# EAGLE design T09_LockBox_ver6 (EAGLE 7.7.0)
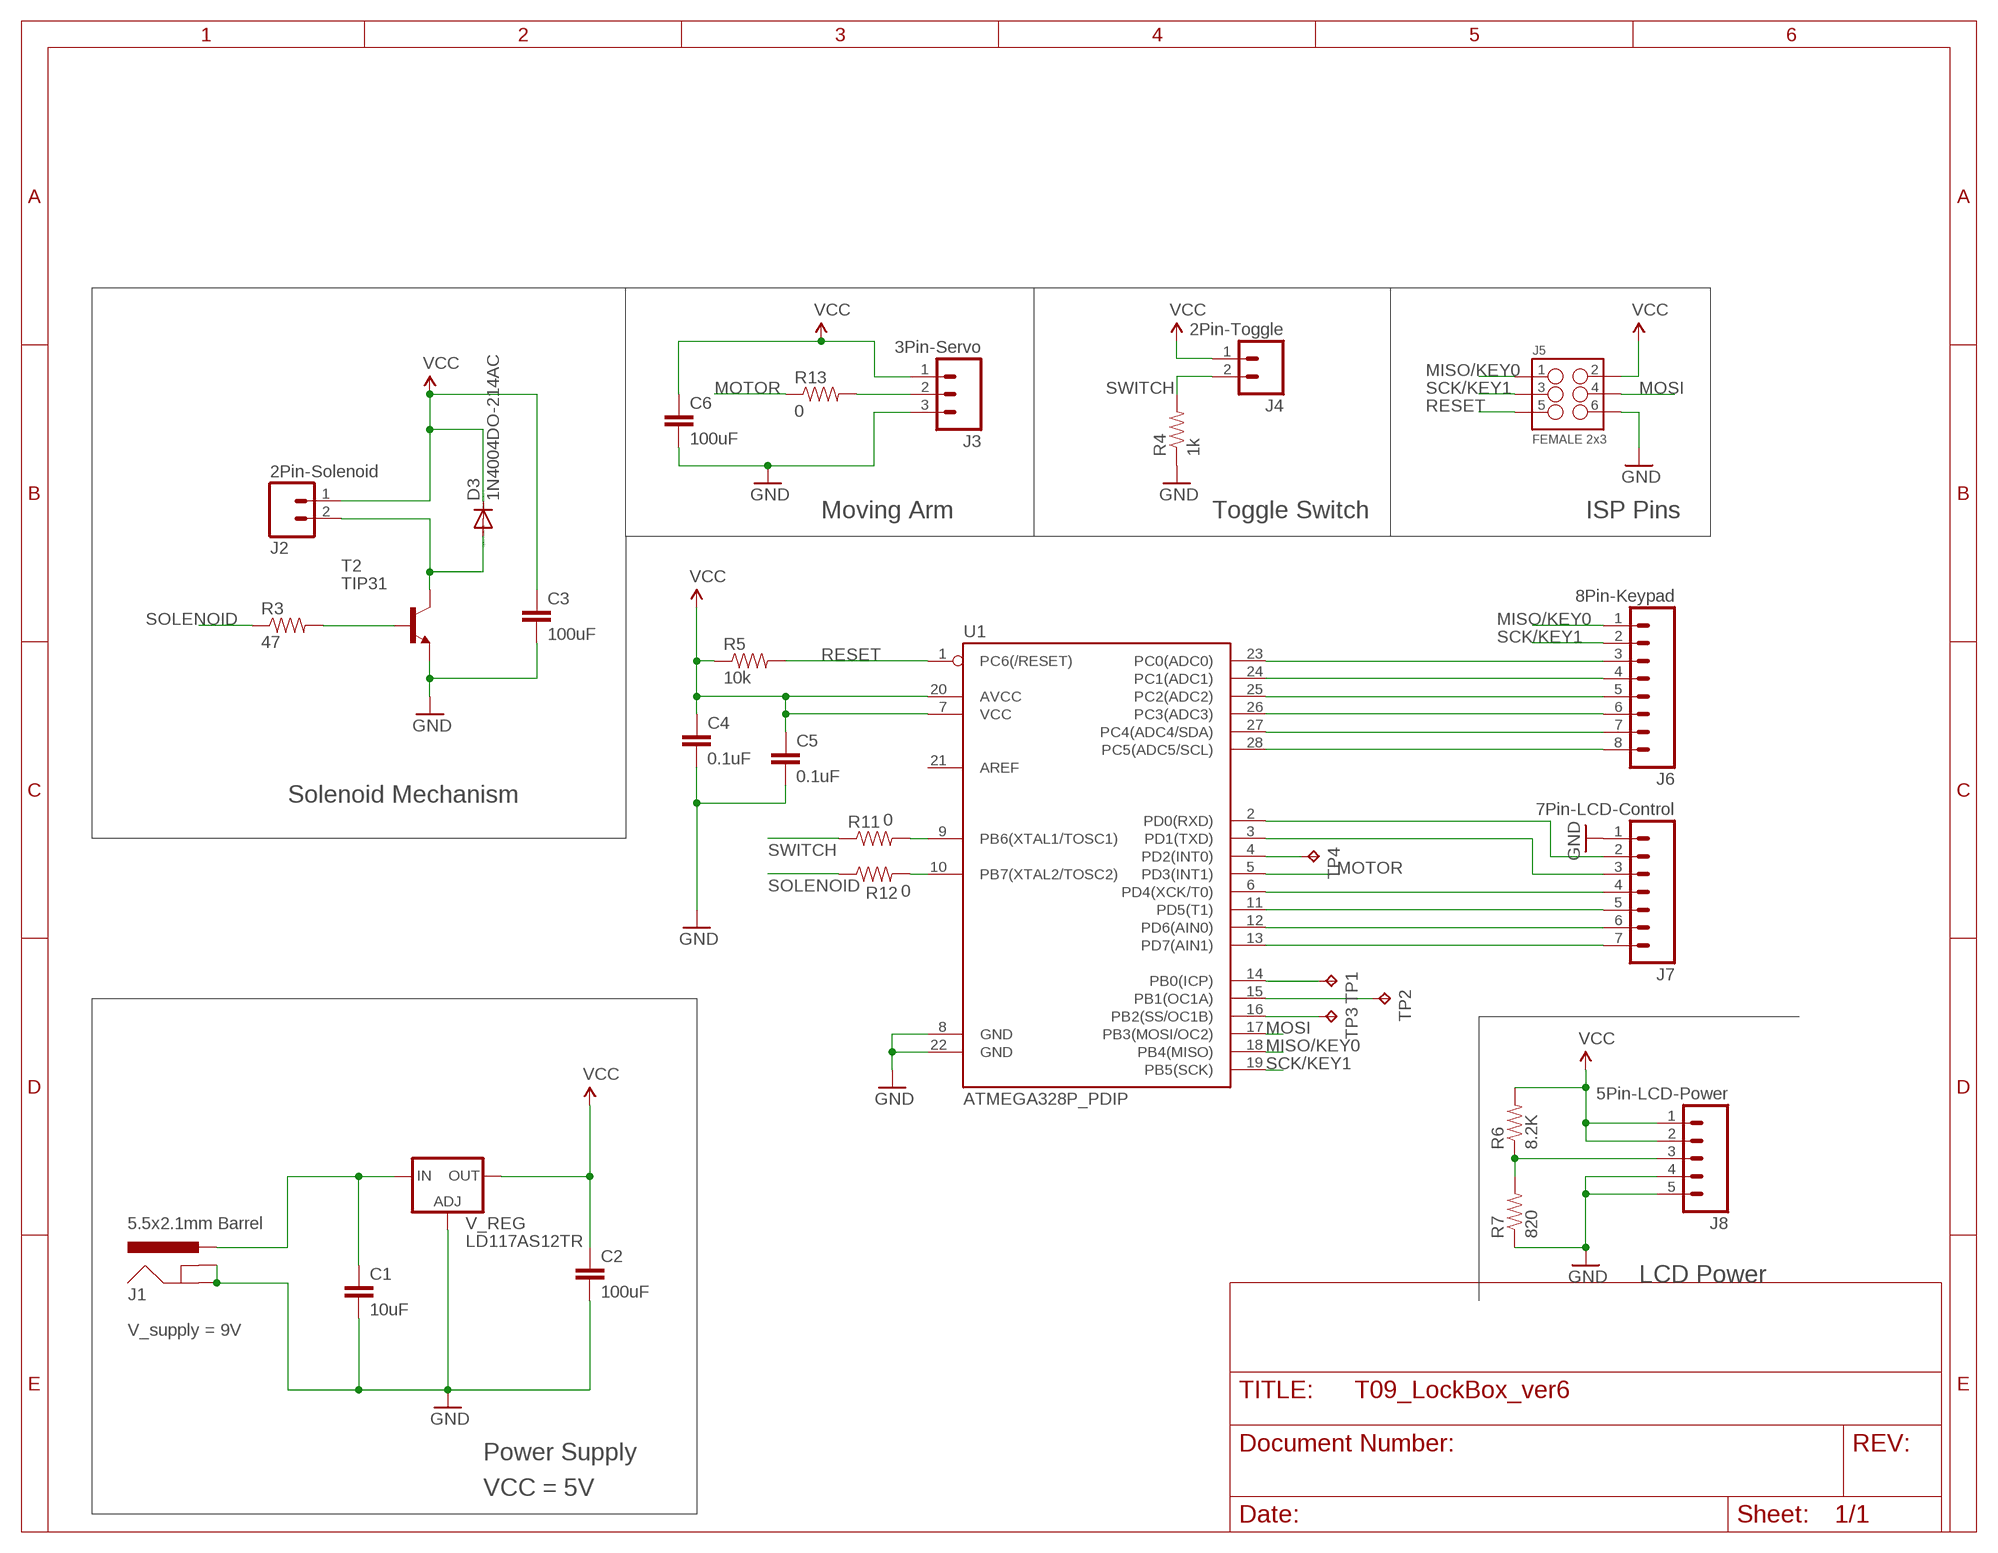
[diagram p0: schematic, sheet 1]

## Parts
C1  10uF  CAP0603-CAP  [0603-CAP]
C2  100uF  CAP0603-CAP  [0603-CAP]
C3  100uF  CAP0603-CAP  [0603-CAP]
C4  0.1uF  CAP0603-CAP  [0603-CAP]
C5  0.1uF  CAP0603-CAP  [0603-CAP]
C6  100uF  CAP0603-CAP  [0603-CAP]
D3  1N4004DO-214AC  [DO-214AC]
J1  5.5x2.1mm Barrel  POWER_JACKSMD  [POWER_JACK_SMD]
J2  2Pin-Solenoid  M02PTH  [1X02]
J3  3Pin-Servo  M03PTH  [1X03]
J4  2Pin-Toggle  M02PTH  [1X02]
J5  FEMALE 2x3  M03X2FEMALE  [2X3]
J6  8Pin-Keypad  M08  [1X08_ROUND]
J7  7Pin-LCD-Control  M07  [1X07]
J8  5Pin-LCD-Power  M05PTH  [1X05]
R3  47  RESISTOR0805-RES  [0805]
R4  1k  RESISTOR0603  [0603-RES]
R5  10k  RESISTOR0603  [0603-RES]
R6  8.2K  RESISTOR0603  [0603-RES]
R7  820  RESISTOR0603  [0603-RES]
R11  0  RESISTOR0603  [0603-RES]
R12  0  RESISTOR0603  [0603-RES]
R13  0  RESISTOR0603  [0603-RES]
T2  TIP31  [TO220]
TP1  TPPAD1-13  [P1-13]
TP2  TPPAD1-13  [P1-13]
TP3  TPPAD1-13  [P1-13]
TP4  TPPAD1-13  [P1-13]
U1  ATMEGA328P_PDIP  [DIL28-3]
V_REG  LD117AS12TR  [SOT223]

## Nets
GND: C1.2 C2.2 C3.2 C4.2 C5.2 C6.2 J1.GND(GNDBREAK) J1.P$4(GND) J3.3 J5.6 J7.1 J8.4 J8.5 R4.1 R7.1 T2.3(E) U1.8(GND) U1.22(GND) V_REG.1(ADJ)
MISO/KEY0: J5.1 J6.1 U1.18(PB4(MISO))
MOSI: J5.4 U1.17(PB3(MOSI/OC2))
MOTOR: R13.1 U1.5(PD3(INT1))
N$1: D3.A J2.2 T2.2(C)
N$2: J8.3 R6.1 R7.2
N$5: R3.2 T2.1(B)
N$8: J7.2 U1.2(PD0(RXD))
N$9: R11.2 U1.9(PB6(XTAL1/TOSC1))
N$10: R12.2 U1.10(PB7(XTAL2/TOSC2))
N$11: J3.2 R13.2
N$12: J7.3 U1.3(PD1(TXD))
N$13: J7.4 U1.6(PD4(XCK/T0))
N$14: J7.5 U1.11(PD5(T1))
N$15: J7.6 U1.12(PD6(AIN0))
N$16: J7.7 U1.13(PD7(AIN1))
N$17: J6.3 U1.23(PC0(ADC0))
N$18: J6.4 U1.24(PC1(ADC1))
N$19: J6.5 U1.25(PC2(ADC2))
N$20: J6.6 U1.26(PC3(ADC3))
N$21: J6.7 U1.27(PC4(ADC4/SDA))
N$22: J6.8 U1.28(PC5(ADC5/SCL))
N$24: TP4.TP U1.4(PD2(INT0))
N$25: TP1.TP U1.14(PB0(ICP))
N$26: TP2.TP U1.15(PB1(OC1A))
N$27: TP3.TP U1.16(PB2(SS/OC1B))
RESET: J5.5 R5.2 U1.1(PC6(/RESET))
SCK/KEY1: J5.3 J6.2 U1.19(PB5(SCK))
SOLENOID: R3.1 R12.1
SWITCH: J4.2 R4.2 R11.1
VCC: C2.1 C3.1 C4.1 C5.1 C6.1 D3.C J2.1 J3.1 J4.1 J5.2 J8.1 J8.2 R5.1 R6.2 U1.7(VCC) U1.20(AVCC) V_REG.4(OUT)
VIN: C1.1 J1.VIN0(PWR) V_REG.3(IN)
Unconnected: U1.21(AREF)

## Notes on the sheet
- Moving Arm | Toggle Switch | ISP Pins
- Solenoid Mechanism
- LCD Power
- V_supply = 9V
- Power Supply
- VCC = 5V

## Library data of the parts
C1-C6 = SparkFun-Passives:CAP: Capacitor Standard 0603 ceramic capacitor, and 0.1" leaded capacitor.
D3 = diode:1N4004: DIODE general purpose rectifier, 1 A
J1 = SparkFun-Connectors:POWER_JACK: Power Jack This is the standard 5.5mm barrel jack for power. The PTH is the most common, proven, reliable, footprint. The Slot footprint only works if the mill layer is transmitted to the PCB fab house so be warned. Mating wall wart : TOL-00298 (and others); PROD_ID: CONN-08106; SF_ID: PRT-12748
J2 J4 = SparkFun-Connectors:M02: Standard 2-pin 0.1" header. Use with - straight break away headers ( PRT-00116) - right angle break away headers (PRT-00553) - swiss pins (PRT-00743) - machine pins (PRT-00117) - female headers (PRT-00115) Molex polarized connector foot print use with: PRT-08233 with associated crimp pins and housings. 2.54_SCREWTERM for use with PRT-10571. 3.5mm Screw Terminal footprints for PRT-08084 5mm Screw Terminal footprints for use with PRT-08432
J3 = SparkFun-Connectors:M03: Header 3 Standard 3-pin 0.1" header. Use with straight break away headers (SKU : PRT-00116), right angle break away headers (PRT-00553), swiss pins (PRT-00743), machine pins (PRT-00117), and female headers (PRT-00115). Molex polarized connector foot print use with SKU : PRT-08232 with associated crimp pins and housings.
J5 = SparkFun-Connectors:M03X2: 2x3 .1" header. Shrouded, with keying- CONN-10681 SMT- CONN-11415 Pogo pins- HW-11044; PROD_ID: CONN-11566
J6 = SparkFun-Connectors:M08: Header 8 Standard 8-pin 0.1" header. Use with straight break away headers (SKU : PRT-00116), right angle break away headers (PRT-00553), swiss pins (PRT-00743), machine pins (PRT-00117), and female headers (PRT-00115).; PROD_ID: CONN-08437
J7 = SparkFun-Connectors:M07: Header 7 Standard 7-pin 0.1" header. Use with straight break away headers (SKU : PRT-00116), right angle break away headers (PRT-00553), swiss pins (PRT-00743), machine pins (PRT-00117), and female headers (PRT-00115). NOTES ON THE VARIANTS LOCK and LOCK_LONGPADS... This footprint was designed to help hold the alignment of a through-hole component (i.e. 7-pin header) while soldering it into place. You may notice that each hole has been shifted either up or down by 0.005 of an inch from it's more standard position (which is usually a perfectly straight line). This slight alteration caused the pins (the squares in the middle) to touch the edges of the holes. Because they are alternating, it causes a "brace" to hold the header in place. 0.005 has proven to be the perfect amount of "off-center" position when using our standard breakaway headers. Although looks a little odd when you look at the bare footprint, once you have a header in there, the alteration is very hard to notice. Also, if you push a header all the way into place, it is covered up entirely on the bottom side. This idea of altering the position of holes to aid alignment will be further integrated into the Sparkfun Library for other footprints. It can help hold any component with 3 or more connection pins.
J8 = SparkFun-Connectors:M05: Header 5 Standard 5-pin 0.1" header. Use with straight break away headers (SKU : PRT-00116), right angle break away headers (PRT-00553), swiss pins (PRT-00743), machine pins (PRT-00117), and female headers (PRT-00115). Molex polarized connector foot print use with SKU : PRT-08230 with associated crimp pins and housings.
R3-R7 R11-R13 = SparkFun-Resistors:RESISTOR: Resistor Basic schematic elements and footprints for 0603, 1206, and PTH resistors.
T2 = transistor:TIP31: NPN Transistor Medium Power Linear Switching Applications Source: http://onsemi.com
TP1-TP4 = testpad:TP: Test pad
U1 = SparkFun-DigitalIC:ATMEGA328P_PDIP: uC used in the Arduino 32kb flash, 1k EEPROM, 2k SRAM This is the through-hole version of this chip.
V_REG = v-reg:LD117A?*: Low drop fixed and adjustable positive voltage regulators 1 A Source: http://www.st.com/stonline/products/literature/ds/7194/ld1117axx.pdf

## Board
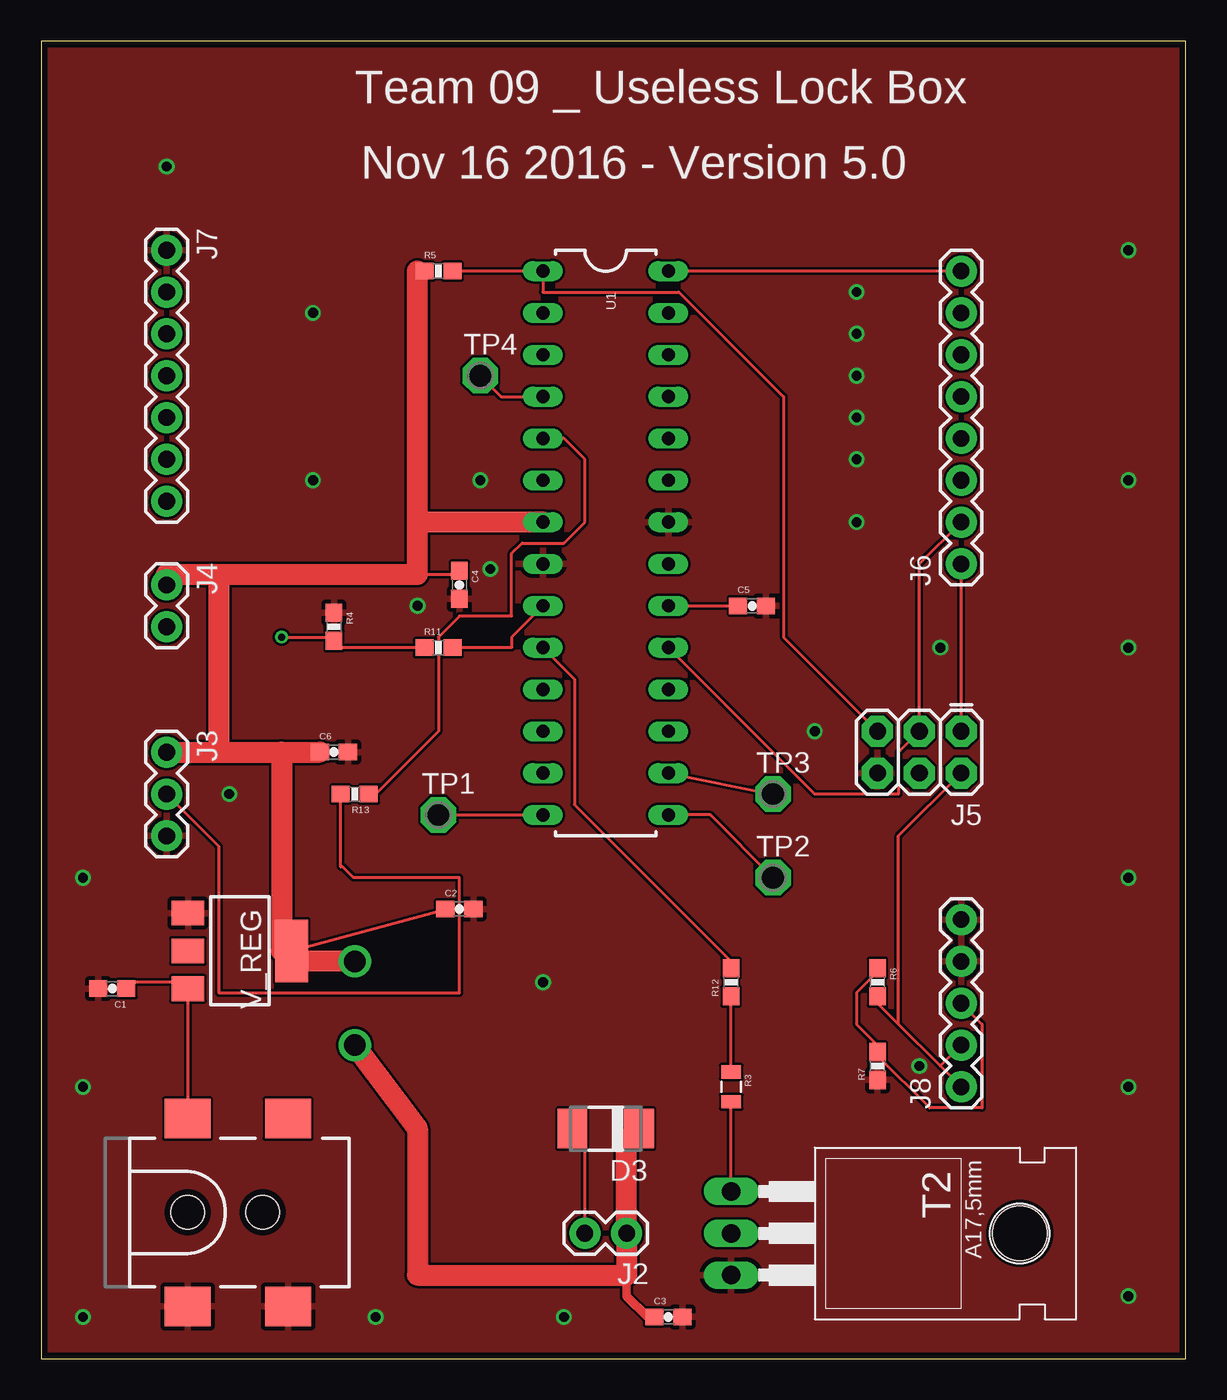
[diagram p1: board, top side]
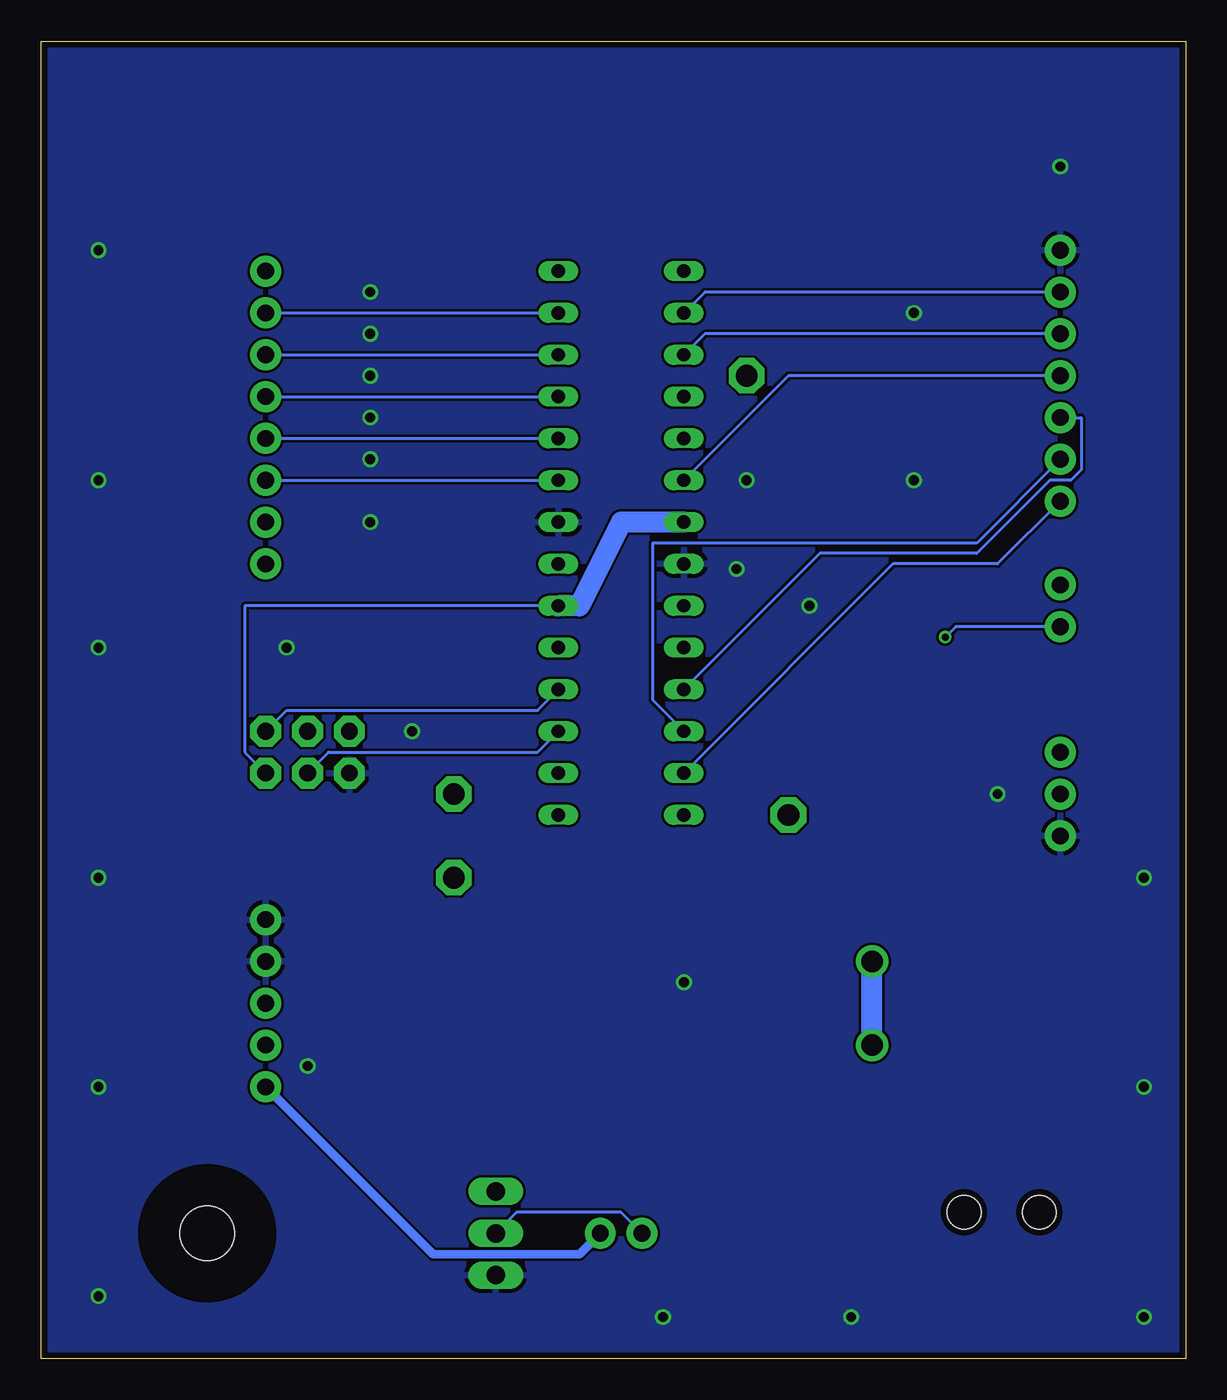
[diagram p2: board, bottom side, seen from below]

Size 69.52 x 80 mm. Coordinates in mm from the lower left corner, seen from the top.
Outline: 0,0 69.52,0 69.52,80 0,80 0,0
Copper layers (1*16): Top 0.0356mm / dielectric 1.5011mm / Bottom 0.0356mm
Design rules "OSH-Park-2-layer": minimum track width 6mil, minimum drill 13mil, track to track 6mil, track to pad 6mil, pad to pad 6mil, via to via 6mil, smd to smd 6mil, copper to edge 15mil, drill to drill 6mil, minimum pad ring 7mil, minimum via ring 7mil, stop-mask expansion 3mil, vias tented up to drill 0mil, thermal gap 10mil

### Footprints (pad centres in the part's own frame; a part is rotated, then mirrored left to right if it is on the bottom)
0603-CAP = smd 1.1 x 1: 1 -0.85,0; 2 0.85,0
DO-214AC = smd 1.8 x 2.4: A 2.025,0; C -2.025,0
POWER_JACK_SMD = smd 2.8 x 2.4: GND 0,-5.7; P$4 6.1,-5.7; VIN0 0,5.7; VIN1 6.1,5.7 | hole 2.032: 0,0; 4.572,0
1X02 = drill 1.016 pad 1.88: 1 0,0; 2 2.54,0
1X03 = drill 1.016 pad 1.88: 1 0,0; 2 2.54,0; 3 5.08,0
2X3 = drill 1.016 pad 1.88 octagon: 1 0,0; 2 0,2.54; 3 2.54,0; 4 2.54,2.54; 5 5.08,0; 6 5.08,2.54
1X08_ROUND = drill 1.016 pad 1.88: 1 0,0; 2 2.54,0; 3 5.08,0; 4 7.62,0; 5 10.16,0; 6 12.7,0; 7 15.24,0; 8 17.78,0
1X07 = drill 1.016 pad 1.88: 1 0,0; 2 2.54,0; 3 5.08,0; 4 7.62,0; 5 10.16,0; 6 12.7,0; 7 15.24,0
1X05 = drill 1.016 pad 1.88: 1 0,0; 2 2.54,0; 3 5.08,0; 4 7.62,0; 5 10.16,0
0805 = smd 0.8 x 1.2: 1 -0.9,0; 2 0.9,0
0603-RES = smd 1.1 x 1: 1 -0.85,0; 2 0.85,0
TO220 = drill 1.118 long: 1 -2.54,-6.35; 2 0,-6.35; 3 2.54,-6.35 | hole 3.302: 0,11.176
P1-13 = drill 1.321 pad 2.159 octagon: TP 0,0
DIL28-3 = drill 0.813 long: 1 -16.51,-3.81; 2 -13.97,-3.81; 3 -11.43,-3.81; 4 -8.89,-3.81; 5 -6.35,-3.81; 6 -3.81,-3.81; 7 -1.27,-3.81; 8 1.27,-3.81; 9 3.81,-3.81; 10 6.35,-3.81; 11 8.89,-3.81; 12 11.43,-3.81; 13 13.97,-3.81; 14 16.51,-3.81; 15 16.51,3.81; 16 13.97,3.81; 17 11.43,3.81; 18 8.89,3.81; 19 6.35,3.81; 20 3.81,3.81; 21 1.27,3.81; 22 -1.27,3.81; 23 -3.81,3.81; 24 -6.35,3.81; 25 -8.89,3.81; 26 -11.43,3.81; 27 -13.97,3.81; 28 -16.51,3.81
SOT223 = smd 1.5 x 2: 1 -2.3,-3.15; 2 0,-3.15; 3 2.3,-3.15 | smd 3.8 x 2: 4 0,3.15

### Placement (x,y rotation side)
C1  4.32,22.48 180 top
C2  25.4,27.3 0 top
C3  38.1,2.54 0 top
C4  25.4,46.99 270 top
C5  43.18,45.72 0 top
C6  17.78,36.83 0 top
D3  34.29,13.97 180 top
J1  8.89,8.89 0 top
J2  35.56,7.62 180 top
J3  7.62,36.83 270 top
J4  7.62,46.99 270 top
J5  55.88,38.1 180 top
J6  55.88,48.26 90 top
J7  7.62,67.31 270 top
J8  55.88,16.51 90 top
R3  41.91,16.51 270 top
R4  17.78,44.45 270 top
R5  24.13,66.04 0 top
R6  50.8,22.86 270 top
R7  50.8,17.78 90 top
R11  24.13,43.18 0 top
R12  41.91,22.86 90 top
R13  19.05,34.29 180 top
T2  48.26,7.62 270 top
TP1  24.13,33.02 0 top
TP2  44.45,29.21 0 top
TP3  44.45,34.29 0 top
TP4  26.67,59.69 0 top
U1  34.29,49.53 270 top
V_REG  12.06,24.77 270 top

### Tracks (layer width: path | path; a pad name or v marks a point on that pad's centre or on a via)
GND  (via drill 0.6)
  other vias: 7.62,72.39 16.51,63.5 49.53,59.69 49.53,62.23 49.53,64.77 49.53,57.15 49.53,54.61 49.53,50.8 22.86,45.72 66.04,3.81 66.04,16.51 66.04,29.21 66.04,43.18 66.04,53.34 66.04,67.31 54.61,43.18 46.99,38.1 53.34,17.78 27.28,47.96 26.67,53.34 31.75,2.54 20.32,2.54 2.54,2.54 2.54,16.51 2.54,29.21 11.43,34.29 16.51,53.34 30.48,22.86
  pour Bottom: 0,81.28 69.85,81.28 69.85,-1.27 0,-1.27
  pour Top: 0,81.28 69.85,81.28 69.85,-1.27 0,-1.27
MISO/KEY0
  Top 0.178: J5.1 J6.1
  Bottom 0.178: U1.18 39.37,39.37 54.61,39.37 J5.1
MOSI
  Bottom 0.178: U1.17 39.37,36.83 52.07,36.83 J5.4
MOTOR
  Top 0.178: R13.1 20.32,34.29 24.13,38.1 24.13,43.81 25.4,45.09 28.57,45.09 28.57,48.9 29.21,49.53 31.75,49.53 33.02,50.8 33.02,54.61 31.75,55.88 U1.5
N$1
  Top 0.178: J2.2 33.02,13.34 32.38,13.97 D3.A
  Bottom 0.178: T2.2 40.64,8.89 34.29,8.89 J2.2
N$2
  Top 0.178: R6.1 50.8,23.5 49.53,22.23 49.53,20.32 50.8,19.05 R7.2 50.8,18.41 53.98,15.24 57.15,15.24 57.15,20.32 J8.3
N$5
  Top 0.178: T2.1 R3.2
N$8
  Bottom 0.178: U1.2 29.21,64.77 J7.2
N$9
  Top 0.178: R11.2 28.57,43.18 28.57,43.81 U1.9
N$10
  Top 0.178: U1.10 32.38,41.27 32.38,33.66 41.91,24.13 R12.2
N$11
  Top 0.178: J3.2 10.79,31.11 10.79,22.23 25.4,22.23 25.4,29.21 18.97,29.21 18.31,29.87 18.2,29.87 R13.2 18.19,34.29
N$12
  Bottom 0.178: U1.3 29.21,62.23 J7.3
N$13
  Bottom 0.178: U1.6 24.13,59.69 J7.4
N$14
  Bottom 0.178: U1.11 22.23,48.9 12.7,48.9 8.26,53.34 6.99,53.34 6.35,53.98 6.35,57.15 J7.5
N$15
  Bottom 0.178: U1.12 32.38,40.01 32.38,49.53 12.7,49.53 J7.6
N$16
  Bottom 0.178: U1.13 17.78,48.26 11.43,48.26 J7.7
N$17
  Bottom 0.178: J6.3 U1.23
N$18
  Bottom 0.178: J6.4 U1.24
N$19
  Bottom 0.178: J6.5 U1.25
N$20
  Bottom 0.178: J6.6 U1.26
N$21
  Bottom 0.178: J6.7 U1.27
N$22
  Top 0.178: J6.8 U1.28
N$24
  Top 0.178: TP4.TP 27.94,58.42 U1.4
N$25
  Top 0.178: TP1.TP U1.14
N$26
  Top 0.178: TP2.TP 40.64,33.02 U1.15
N$27
  Top 0.178: U1.16 TP3.TP
RESET
  Top 0.178: R5.2 U1.1 30.48,64.77 38.73,64.77 45.09,58.42 45.09,43.81 J5.5
SCK/KEY1
  Top 0.178: U1.19 46.99,34.29 52.07,34.29 52.07,36.83 J5.3 53.34,48.26 J6.2
SOLENOID
  Top 0.178: R3.1 R12.1
SWITCH  (via drill 0.41)
  Top 0.178: R11.1 17.78,43.18 R4.2 17.78,43.81 v14.61,43.81
  Bottom 0.178: v14.61,43.81 13.97,44.45 J4.2
VCC  (via drill 1.3)
  Top 0.178: 36.83,2.54 C3.1 | 35.56,13.34 36.2,13.97 D3.C | J8.1 54.61,17.78 | 54.61,17.78 52.07,20.32 | 52.07,20.32 50.8,21.59 R6.2 | 54.61,17.78 J8.2 | J5.2 52.07,31.75 52.07,20.32 | C2.1 V_REG.4 14.61,24.77 | U1.20 C5.1 | 22.86,47.62 25.4,47.62 C4.1 | J4.1 7.62,47.62 | 22.86,66.04 R5.1
  Top 0.508: 36.83,2.54 35.56,3.81 35.56,5.08
  Top 1.27: 35.56,13.34 J2.1 35.56,5.08 22.86,5.08 22.86,13.97 v19.05,19.05 | J3.1 10.79,36.83 | 10.79,36.83 14.61,36.83 | 14.61,36.83 14.61,24.77 | 14.61,36.83 C6.1 | 7.62,47.62 10.79,47.62 | 10.79,47.62 22.86,47.62 22.86,50.8 | 22.86,50.8 22.86,66.04 | 10.79,47.62 10.79,36.83 | v19.05,24.13 15.24,24.13 | U1.7 22.86,50.8
  Bottom 0.178: J5.2 57.15,36.83 57.15,45.72 U1.20
  Bottom 0.508: J2.1 36.83,6.35 45.72,6.35 J8.1
  Bottom 1.27: v19.05,19.05 v19.05,24.13 | U1.7 34.29,50.8 36.83,45.72 U1.20
VIN
  Top 0.178: C1.1 5.71,22.86 8.89,22.86 V_REG.3 8.89,22.23 J1.VIN0

### Text on the board
tPlace: Team 09 _ Useless Lock Box | Nov 16 2016 - Version 5.0